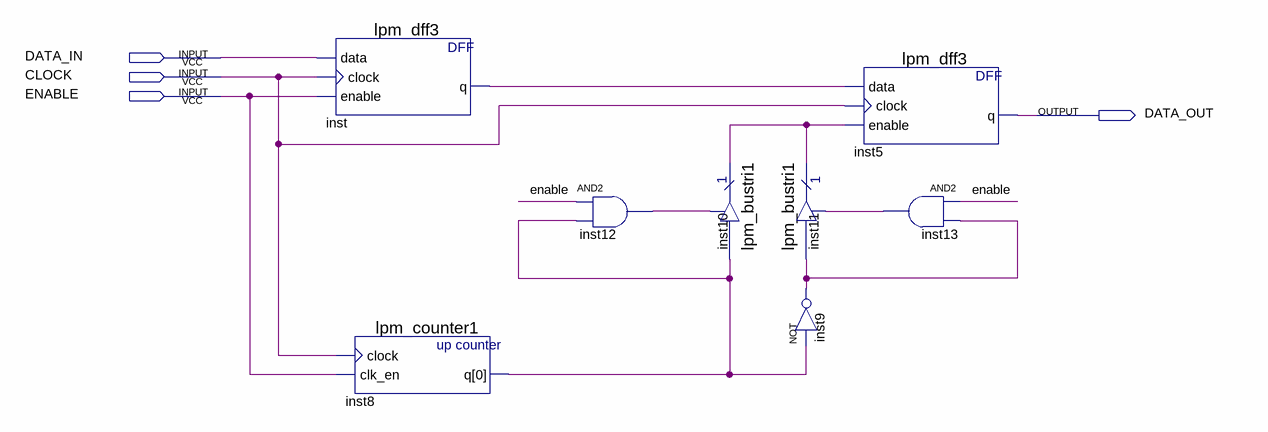
[diagram p0: schematic sheet]
// Quartus schematic DELAY.bdf as structural Verilog: 8 symbols, 4 pins
module DELAY (
  input  DATA_IN,
  input  CLOCK,
  input  ENABLE,
  output DATA_OUT
);

  wire inst8_q, inst9_out, inst10_tridata, inst12_out, inst13_out, inst_q;

  lpm_dff3 inst (.data(DATA_IN), .clock(CLOCK), .enable(ENABLE), .q(inst_q));
  lpm_counter1 inst8 (.clock(CLOCK), .clk_en(ENABLE), .q(inst8_q));
  and inst12 (inst12_out, ENABLE, inst8_q);
  lpm_bustri1 inst10 (.enabledt(inst12_out), .data(inst8_q), .tridata(inst10_tridata));
  lpm_dff3 inst5 (.data(inst_q), .clock(CLOCK), .enable(inst10_tridata), .q(DATA_OUT));
  lpm_bustri1 inst11 (.enabledt(inst13_out), .data(inst9_out), .tridata(inst10_tridata));
  not inst9 (inst9_out, inst8_q);
  and inst13 (inst13_out, ENABLE, inst9_out);
endmodule
